# EAGLE schematic TPS3813 (EAGLE 9.6.2)
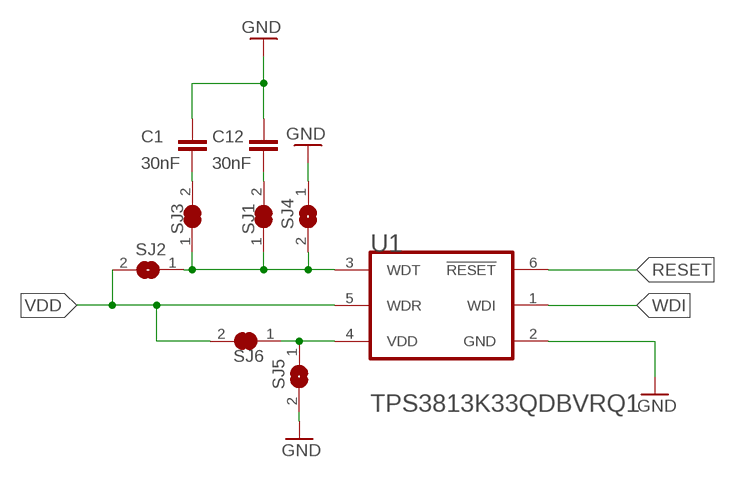
[diagram p0: schematic, sheet 1]

## Parts
C1  30nF  C-EUC0603  [C0603]
C12  30nF  C-EUC0603  [C0603]
SJ1  SOLDERJUMPER_CLOSED  [SOLDERJUMPER_CLOSEDWIRE]
SJ2  SJ  [SJ]
SJ3  SOLDERJUMPER_CLOSED  [SOLDERJUMPER_CLOSEDWIRE]
SJ4  SJ  [SJ]
SJ5  SJ  [SJ]
SJ6  SOLDERJUMPER_CLOSED  [SOLDERJUMPER_CLOSEDWIRE]
U1  TEXAS_INSTRUMENTS_TPS3813K33QDBVRQ1TEXAS_INSTRUMENTS_TPS3813K33QDBVRQ1_0_2  [TEXAS_INSTRUMENTS_TPS3813K33QDBVRQ1_2]

## Nets
GND: C1.1 C12.1 SJ4.1 SJ5.2 U1.2(GND)
N$1: C12.2 SJ1.2
N$2: C1.2 SJ3.2
N$3: SJ5.1 SJ6.1 U1.4(VDD)
RESET: U1.6(!RESET!)
VCC: SJ1.1 SJ2.1 SJ3.1 SJ4.2 U1.3(WDT)
VDD: SJ2.2 SJ6.2 U1.5(WDR)
WDI: U1.1(WDI)

## Library data of the parts
C1 C12 = rcl:C-EU: CAPACITOR, European symbol
SJ1 SJ3 SJ6 = microbuilder:SOLDERJUMPER_CLOSED: Solder Jumper - Closed These solder jumpers are closed by default CLOSEDWIRE - 10 mil trace between pads that can be cut and resoldered later CLOSEDPERM - 63 mil trace between pads for a permanent connection (used to 'bridge' two signals, a shameless hack for Eagle). Can double as a test point as well (no cream layer)
SJ2 SJ4 SJ5 = jumper:SJ: SMD solder JUMPER
U1 = TPS3813K33QDBVRQ1:TEXAS_INSTRUMENTS_TPS3813K33QDBVRQ1: TI-TPS3813K33-Q1DBV6; CIIVA_IDS: 1440665; CODE__JEDEC: MO-178-AB*; DATASHEET: http://www.ti.com/general/docs/lit/getliterature.tsp?genericPartNumber=TPS3813K33-Q1&fileType=pdf; DATASHEET_VERSION: SPRS288B; FOOTPRINT_VARIANT_NAME_0: Level C; FOOTPRINT_VARIANT_NAME_1: Level B; FOOTPRINT_VARIANT_NAME_2: Level A; IMPORTED: yes; IMPORTED_FROM: vault; IMPORT_TS: 1521865220; IQ_TYPU_A: 9; MF: Texas Instruments; MOUNTING_TECHNOLOGY: Surface Mount; MPN: TPS3813K33QDBVRQ1; OF_SUPPLIES_MONITORED: 1; OUTPUT_DRIVER_TYPE__RESET_OUTPUT: Active-low, Open-drain; PACKAGE: DBV0006A; PACKAGE_DESCRIPTION: 6-Pin Plastic Small-Outline Package, 2.9 x 1.6 mm Body, 0.95 mm Pitch, 2.8 mm Lead Span; PACKAGE_VERSION: revK, Mar-2006; PREFIX: U; RATING: Automotive; RELEASE_DATE: 1464589544; RESET_THRESHOLD_ACCURACY: 2.2; SUB_FAMILY: Supervisor and Reset IC; THRESHOLD_VOLTAGE_1_TYPTYPV: 2.93; TIME_DELAYMS: 25; VAULT_GUID: 16992C0F-93AD-46DD-BDFA-7B86A304BB2F; VAULT_REVISION: 5E131F35-F181-497A-9BE1-C5937D2744DB; VCC_MAX_V: 6; VCC_MIN_V: 2; WATCHDOG_TIMER_WDISEC: Programmable